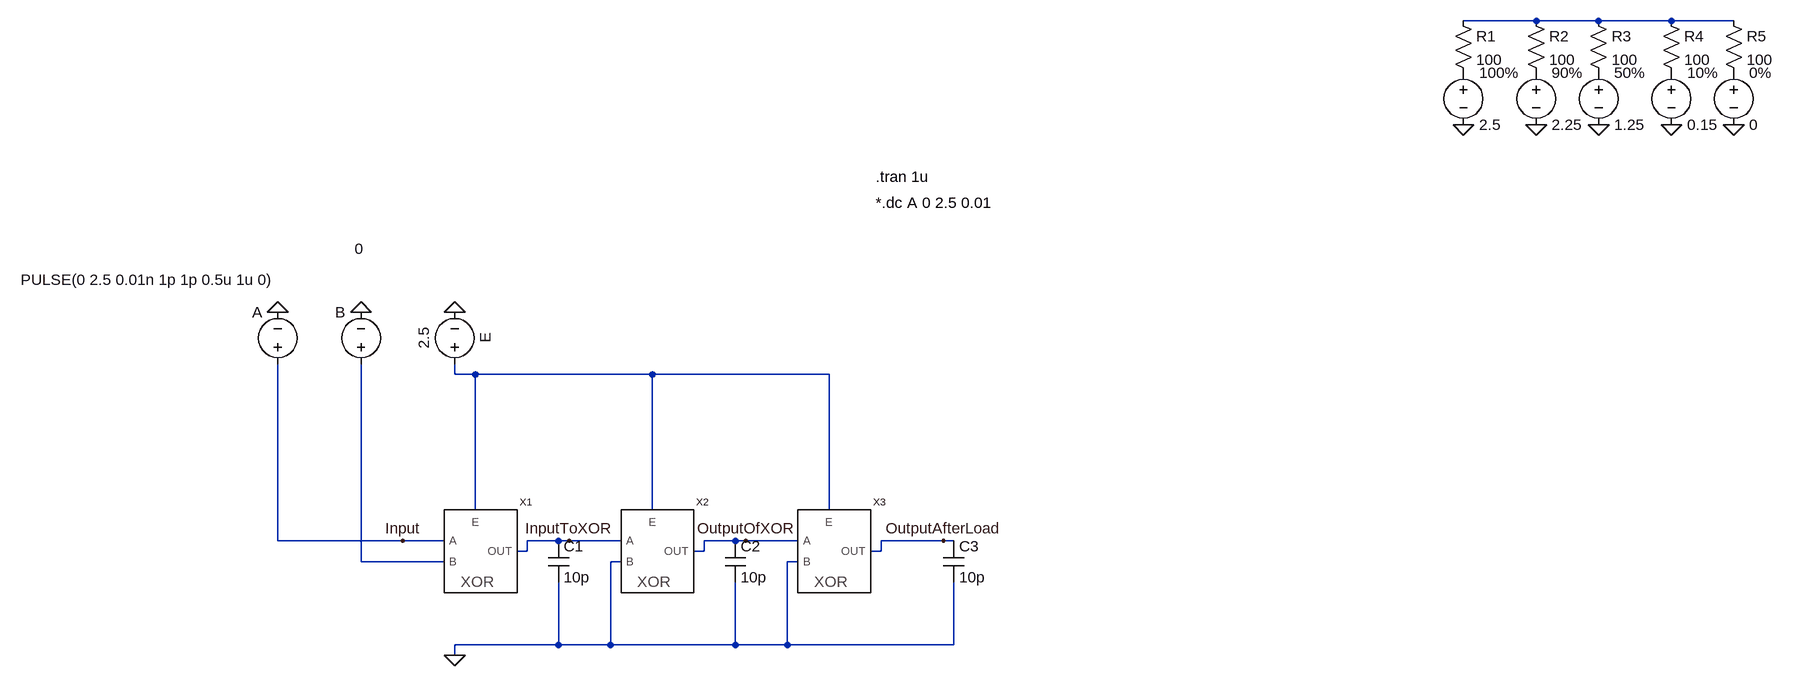
[diagram p0: schematic hw2.asc]
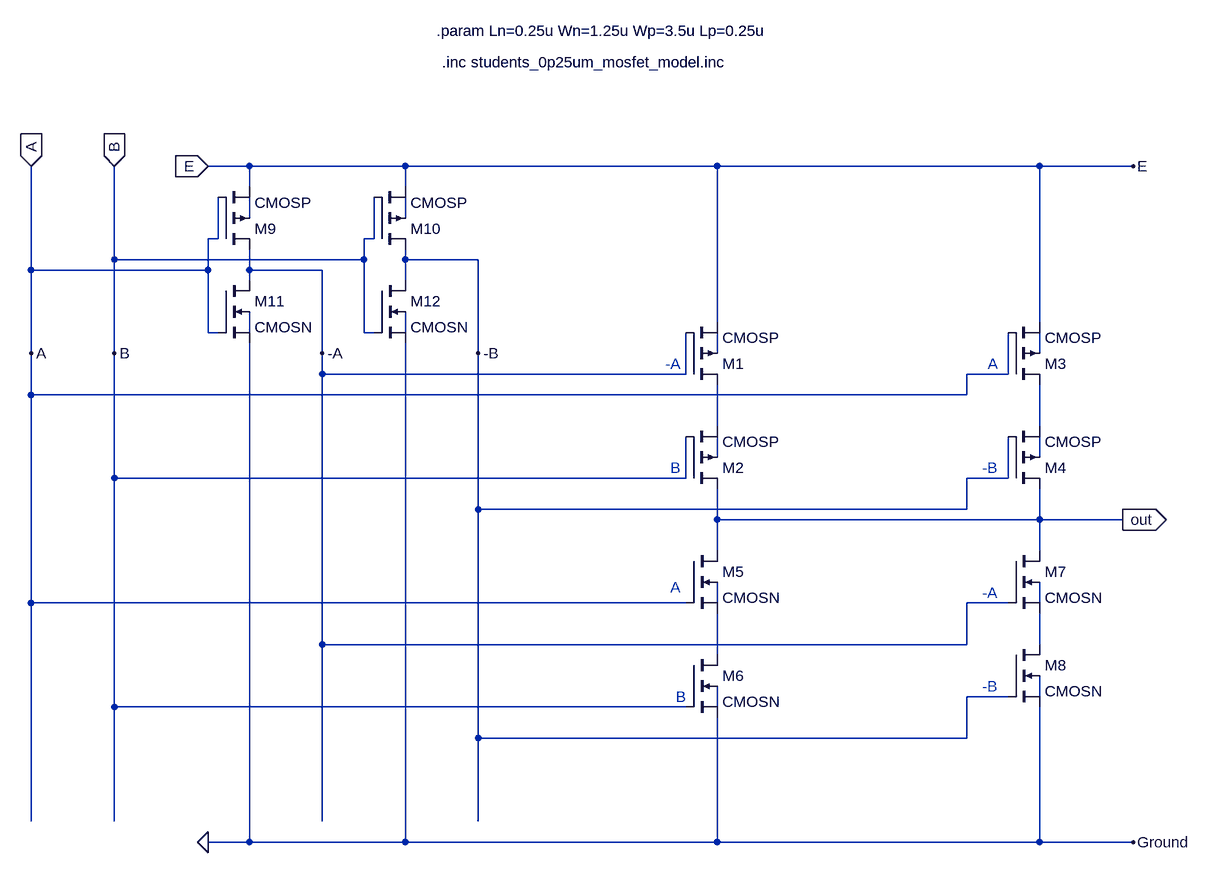
[diagram p1: sub-circuit xor.asc]
hw2.asc, the LTspice schematic file:
Version 4
SHEET 1 1268 1300
WIRE -2336 -896 -2448 -896
WIRE -2240 -896 -2336 -896
WIRE -2128 -896 -2240 -896
WIRE -2032 -896 -2128 -896
WIRE -4000 -352 -4000 -368
WIRE -3968 -352 -4000 -352
WIRE -3696 -352 -3968 -352
WIRE -3424 -352 -3696 -352
WIRE -3968 -144 -3968 -352
WIRE -3696 -144 -3696 -352
WIRE -3424 -144 -3424 -352
WIRE -4272 -96 -4272 -368
WIRE -4080 -96 -4272 -96
WIRE -4016 -96 -4080 -96
WIRE -3840 -96 -3888 -96
WIRE -3824 -96 -3840 -96
WIRE -3744 -96 -3824 -96
WIRE -3568 -96 -3616 -96
WIRE -3552 -96 -3568 -96
WIRE -3472 -96 -3552 -96
WIRE -3248 -96 -3344 -96
WIRE -3232 -96 -3248 -96
WIRE -3888 -80 -3888 -96
WIRE -3888 -80 -3904 -80
WIRE -3616 -80 -3616 -96
WIRE -3616 -80 -3632 -80
WIRE -3344 -80 -3344 -96
WIRE -3344 -80 -3360 -80
WIRE -4144 -64 -4144 -368
WIRE -4016 -64 -4144 -64
WIRE -3744 -64 -3760 -64
WIRE -3472 -64 -3488 -64
WIRE -3840 64 -3840 -32
WIRE -3840 64 -4000 64
WIRE -3760 64 -3760 -64
WIRE -3760 64 -3840 64
WIRE -3568 64 -3568 -32
WIRE -3568 64 -3760 64
WIRE -3488 64 -3488 -64
WIRE -3488 64 -3568 64
WIRE -3232 64 -3232 -32
WIRE -3232 64 -3488 64
WIRE -4000 80 -4000 64
FLAG -4000 -448 0
FLAG -4144 -448 0
FLAG -4272 -448 0
FLAG -2448 -736 0
FLAG -2336 -736 0
FLAG -2240 -736 0
FLAG -2128 -736 0
FLAG -2032 -736 0
FLAG -4000 80 0
FLAG -4080 -96 Input
FLAG -3824 -96 InputToXOR
FLAG -3552 -96 OutputOfXOR
FLAG -3248 -96 OutputAfterLoad
SYMBOL voltage -4000 -352 R180
WINDOW 0 -32 56 VBottom 2
WINDOW 3 32 56 VTop 2
WINDOW 123 0 0 Left 0
WINDOW 39 0 0 Left 0
SYMATTR InstName E
SYMATTR Value 2.5
SYMBOL voltage -4272 -352 R180
WINDOW 0 24 96 Left 2
WINDOW 3 4 146 Left 2
WINDOW 123 0 0 Left 0
WINDOW 39 0 0 Left 0
SYMATTR InstName A
SYMATTR Value PULSE(0 2.5 0.01n 1p 1p 0.5u 1u 0)
SYMBOL voltage -4144 -352 R180
WINDOW 0 24 96 Left 2
WINDOW 3 -4 193 Left 2
WINDOW 123 0 0 Left 0
WINDOW 39 0 0 Left 0
SYMATTR InstName B
SYMATTR Value 0
SYMBOL voltage -2448 -832 R0
SYMATTR InstName 100%
SYMATTR Value 2.5
SYMBOL voltage -2336 -832 R0
SYMATTR InstName 90%
SYMATTR Value 2.25
SYMBOL voltage -2240 -832 R0
SYMATTR InstName 50%
SYMATTR Value 1.25
SYMBOL voltage -2128 -832 R0
SYMATTR InstName 10%
SYMATTR Value 0.15
SYMBOL voltage -2032 -832 R0
SYMATTR InstName 0%
SYMATTR Value 0
SYMBOL res -2464 -912 R0
SYMATTR InstName R1
SYMATTR Value 100
SYMBOL res -2352 -912 R0
SYMATTR InstName R2
SYMATTR Value 100
SYMBOL res -2256 -912 R0
SYMATTR InstName R3
SYMATTR Value 100
SYMBOL res -2144 -912 R0
SYMATTR InstName R4
SYMATTR Value 100
SYMBOL res -2048 -912 R0
SYMATTR InstName R5
SYMATTR Value 100
SYMBOL cap -3856 -96 R0
SYMATTR InstName C1
SYMATTR Value 10p
SYMBOL cap -3584 -96 R0
SYMATTR InstName C2
SYMATTR Value 10p
SYMBOL cap -3248 -96 R0
SYMATTR InstName C3
SYMATTR Value 10p
SYMBOL XOR -3968 -96 R0
SYMATTR InstName X1
SYMBOL XOR -3696 -96 R0
SYMATTR InstName X2
SYMBOL XOR -3424 -96 R0
SYMATTR InstName X3
TEXT -3352 -616 Left 2 !*.dc A 0 2.5 0.01
TEXT -3352 -656 Left 2 !.tran 1u

xor.asc, the sub-circuit schematic file:
Version 4
SHEET 1 1268 1300
WIRE -3936 -368 -4000 -368
WIRE -3696 -368 -3936 -368
WIRE -3216 -368 -3696 -368
WIRE -2720 -368 -3216 -368
WIRE -2576 -368 -2720 -368
WIRE -3936 -336 -3936 -368
WIRE -3696 -336 -3696 -368
WIRE -3936 -288 -3936 -320
WIRE -3696 -288 -3696 -320
WIRE -3984 -256 -3984 -320
WIRE -3984 -256 -4000 -256
WIRE -3744 -256 -3744 -320
WIRE -3744 -256 -3760 -256
WIRE -4144 -224 -4144 -368
WIRE -3760 -224 -3760 -256
WIRE -3760 -224 -4144 -224
WIRE -3696 -224 -3696 -240
WIRE -3584 -224 -3696 -224
WIRE -4272 -208 -4272 -368
WIRE -4000 -208 -4000 -256
WIRE -4000 -208 -4272 -208
WIRE -3936 -208 -3936 -240
WIRE -3824 -208 -3936 -208
WIRE -3936 -192 -3936 -208
WIRE -3696 -192 -3696 -224
WIRE -3216 -128 -3216 -368
WIRE -2720 -128 -2720 -368
WIRE -4000 -112 -4000 -208
WIRE -3984 -112 -4000 -112
WIRE -3936 -112 -3936 -144
WIRE -3760 -112 -3760 -224
WIRE -3744 -112 -3760 -112
WIRE -3696 -112 -3696 -144
WIRE -4272 -80 -4272 -208
WIRE -4144 -80 -4144 -224
WIRE -3824 -80 -3824 -208
WIRE -3584 -80 -3584 -224
WIRE -3216 -80 -3216 -112
WIRE -2720 -80 -2720 -112
WIRE -3824 -48 -3824 -80
WIRE -3264 -48 -3264 -112
WIRE -3264 -48 -3824 -48
WIRE -2768 -48 -2768 -112
WIRE -2768 -48 -2832 -48
WIRE -4272 -16 -4272 -80
WIRE -2832 -16 -2832 -48
WIRE -2832 -16 -4272 -16
WIRE -3216 32 -3216 -32
WIRE -2720 32 -2720 -32
WIRE -3216 80 -3216 48
WIRE -2720 80 -2720 48
WIRE -4144 112 -4144 -80
WIRE -3264 112 -3264 48
WIRE -3264 112 -4144 112
WIRE -2768 112 -2768 48
WIRE -2768 112 -2832 112
WIRE -3584 160 -3584 -80
WIRE -2832 160 -2832 112
WIRE -2832 160 -3584 160
WIRE -3216 176 -3216 128
WIRE -2720 176 -2720 128
WIRE -2720 176 -3216 176
WIRE -2592 176 -2720 176
WIRE -3216 224 -3216 176
WIRE -2720 224 -2720 176
WIRE -4272 304 -4272 -16
WIRE -3264 304 -4272 304
WIRE -3216 304 -3216 272
WIRE -2768 304 -2832 304
WIRE -2720 304 -2720 272
WIRE -3824 368 -3824 -48
WIRE -2832 368 -2832 304
WIRE -2832 368 -3824 368
WIRE -2720 368 -2720 320
WIRE -3216 384 -3216 320
WIRE -2768 448 -2832 448
WIRE -2720 448 -2720 416
WIRE -4144 464 -4144 112
WIRE -3264 464 -4144 464
WIRE -3216 464 -3216 432
WIRE -3584 512 -3584 160
WIRE -2832 512 -2832 448
WIRE -2832 512 -3584 512
WIRE -4272 640 -4272 304
WIRE -4144 640 -4144 464
WIRE -3824 640 -3824 368
WIRE -3584 640 -3584 512
WIRE -3936 672 -3936 -96
WIRE -3936 672 -4000 672
WIRE -3696 672 -3696 -96
WIRE -3696 672 -3936 672
WIRE -3216 672 -3216 480
WIRE -3216 672 -3696 672
WIRE -2720 672 -2720 464
WIRE -2720 672 -3216 672
WIRE -2576 672 -2720 672
FLAG -2576 -368 E
FLAG -2576 672 Ground
FLAG -4144 -80 B
FLAG -4272 -80 A
FLAG -2592 176 out
IOPIN -2592 176 Out
FLAG -3824 -80 -A
FLAG -3584 -80 -B
FLAG -4272 -368 A
IOPIN -4272 -368 In
FLAG -4144 -368 B
IOPIN -4144 -368 In
FLAG -4000 -368 E
IOPIN -4000 -368 In
FLAG -4000 672 0
SYMBOL pmos4 -3264 -32 M180
SYMATTR InstName M1
SYMATTR Value CMOSP
SYMATTR Value2 l=Lp w=Wp
SYMBOL pmos4 -3264 128 M180
SYMATTR InstName M2
SYMATTR Value CMOSP
SYMATTR Value2 l=Lp w=Wp
SYMBOL pmos4 -2768 -32 M180
SYMATTR InstName M3
SYMATTR Value CMOSP
SYMATTR Value2 l=Lp w=Wp
SYMBOL pmos4 -2768 128 M180
SYMATTR InstName M4
SYMATTR Value CMOSP
SYMATTR Value2 l=Lp w=Wp
SYMBOL nmos4 -3264 224 R0
SYMATTR InstName M5
SYMATTR Value CMOSN
SYMATTR Value2 l=Ln w=Wn
SYMBOL nmos4 -3264 384 R0
SYMATTR InstName M6
SYMATTR Value CMOSN
SYMATTR Value2 l=Ln w=Wn
SYMBOL nmos4 -2768 224 R0
SYMATTR InstName M7
SYMATTR Value CMOSN
SYMATTR Value2 l=Ln w=Wn
SYMBOL nmos4 -2768 368 R0
SYMATTR InstName M8
SYMATTR Value CMOSN
SYMATTR Value2 l=Ln w=Wn
SYMBOL pmos4 -3984 -240 M180
SYMATTR InstName M9
SYMATTR Value CMOSP
SYMATTR Value2 l=Lp w=Wp
SYMBOL pmos4 -3744 -240 M180
SYMATTR InstName M10
SYMATTR Value CMOSP
SYMATTR Value2 l=Lp w=Wp
SYMBOL nmos4 -3984 -192 R0
SYMATTR InstName M11
SYMATTR Value CMOSN
SYMATTR Value2 l=Ln w=Wn
SYMBOL nmos4 -3744 -192 R0
SYMATTR InstName M12
SYMATTR Value CMOSN
SYMATTR Value2 l=Ln w=Wn
TEXT -2800 -64 Left 2 ;A
TEXT -3288 96 Left 2 ;B
TEXT -3288 280 Left 2 ;A
TEXT -3280 448 Left 2 ;B
TEXT -3296 -64 Left 2 ;-A
TEXT -2808 288 Left 2 ;-A
TEXT -2808 96 Left 2 ;-B
TEXT -2808 432 Left 2 ;-B
TEXT -3648 -576 Left 2 !.param Ln=0.25u Wn=1.25u Wp=3.5u Lp=0.25u
TEXT -3640 -528 Left 2 !.inc students_0p25um_mosfet_model.inc

The netlist it stands for:
* hw2.asc
V§E N002 0 2.5
V§A Input 0 PULSE(0 2.5 0.01n 1p 1p 0.5u 1u 0)
V§B N003 0 0
V§100% P001 0 2.5
V§90% P002 0 2.25
V§50% P003 0 1.25
V§10% P004 0 0.15
V§0% P005 0 0
R1 N001 P001 100
R2 N001 P002 100
R3 N001 P003 100
R4 N001 P004 100
R5 N001 P005 100
C1 InputToXOR 0 10p
C2 OutputOfXOR 0 10p
C3 OutputAfterLoad 0 10p
XX1 N002 Input N003 InputToXOR xor
XX2 N002 InputToXOR 0 OutputOfXOR xor
XX3 N002 OutputOfXOR 0 OutputAfterLoad xor

* block symbol definitions
.subckt xor E A B OUT
M1 N007 -A E N005 CMOSP l=Lp w=Wp
M2 out B N007 N009 CMOSP l=Lp w=Wp
M3 N008 A E N006 CMOSP l=Lp w=Wp
M4 out -B N008 N010 CMOSP l=Lp w=Wp
M5 out A N014 N011 CMOSN l=Ln w=Wn
M6 N014 B 0 N016 CMOSN l=Ln w=Wn
M7 out -A N013 N012 CMOSN l=Ln w=Wn
M8 N013 -B 0 N015 CMOSN l=Ln w=Wn
M9 -A A E N001 CMOSP l=Lp w=Wp
M10 -B B E N002 CMOSP l=Lp w=Wp
M11 -A A 0 N003 CMOSN l=Ln w=Wn
M12 -B B 0 N004 CMOSN l=Ln w=Wn
* A
* B
* A
* B
* -A
* -A
* -B
* -B
.param Ln=0.25u Wn=1.25u Wp=3.5u Lp=0.25u
.inc students_0p25um_mosfet_model.inc
.ends xor

.model NMOS NMOS
.model PMOS PMOS
.lib standard.mos
*.dc A 0 2.5 0.01
.tran 1u
.backanno
.end